# Altium schematic sheet fpga12-serdes-power.SchDoc
size Tabloid; SheetNumber: 47; SheetTotal: 71
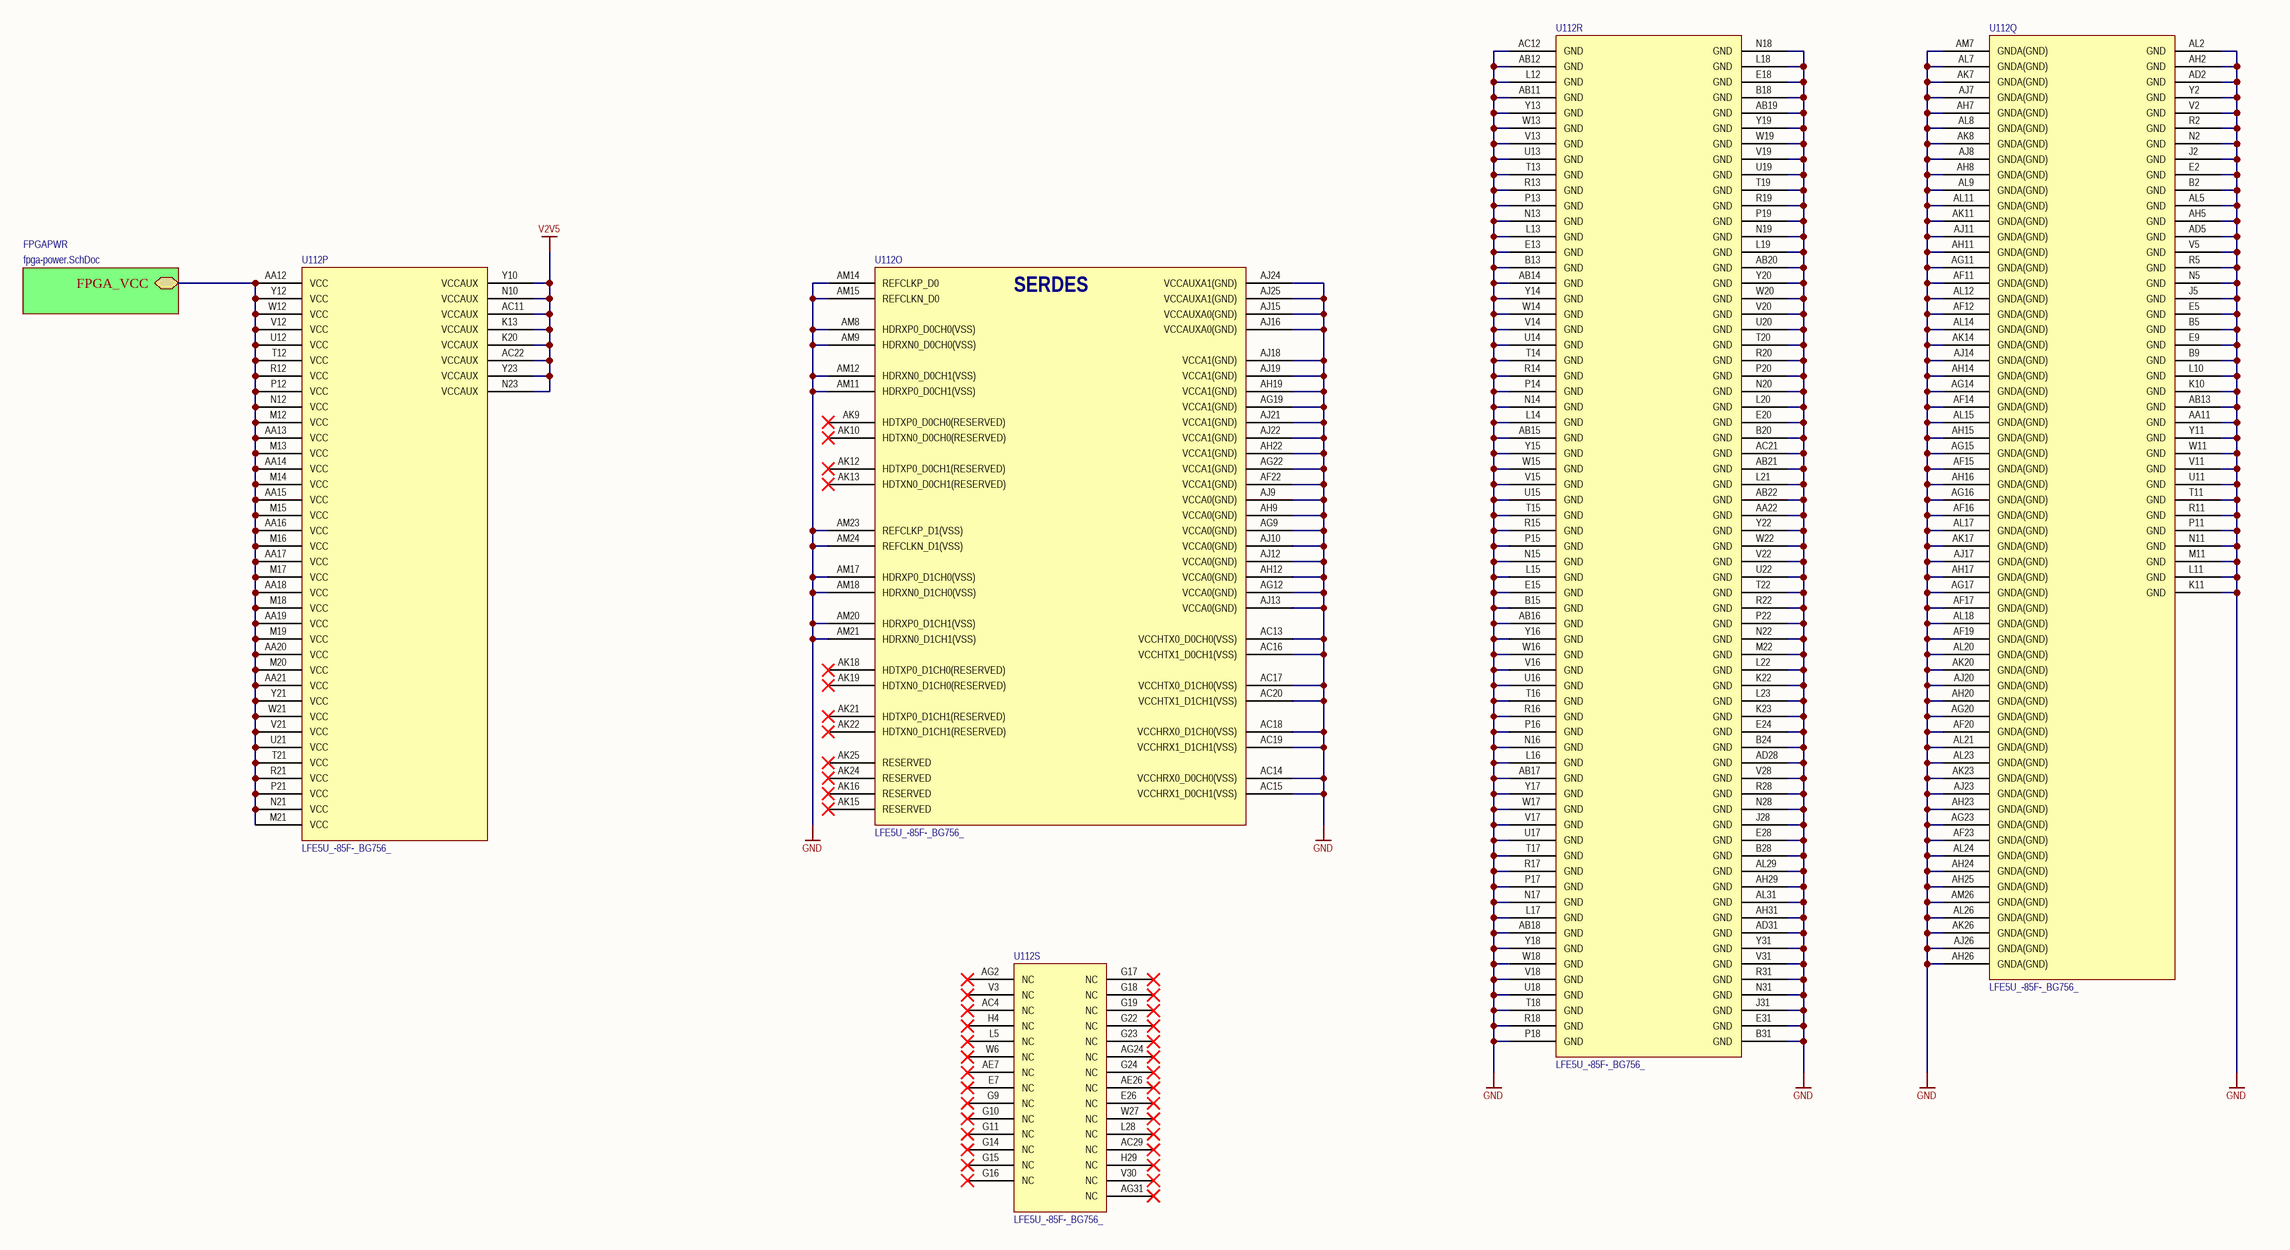
[diagram p0: fpga12-serdes-power.SchDoc]

## Parts
U112  LFE5U_-85F-_BG756_  [caBGA756]  (parts O,P,Q,R,S of 19)

## Sub-sheets
FPGAPWR = fpga-power.SchDoc: FPGA_VCC

## Nets
GND: U112.AA11(GND) U112.AA22(GND) U112.AB11(GND) U112.AB12(GND) U112.AB13(GND) U112.AB14(GND) U112.AB15(GND) U112.AB16(GND) U112.AB17(GND) U112.AB18(GND) U112.AB19(GND) U112.AB20(GND) U112.AB21(GND) U112.AB22(GND) U112.AC12(GND) U112.AC13(VCCHTX0_D0CH0(VSS)) U112.AC14(VCCHRX0_D0CH0(VSS)) U112.AC15(VCCHRX1_D0CH1(VSS)) U112.AC16(VCCHTX1_D0CH1(VSS)) U112.AC17(VCCHTX0_D1CH0(VSS)) U112.AC18(VCCHRX0_D1CH0(VSS)) U112.AC19(VCCHRX1_D1CH1(VSS)) U112.AC20(VCCHTX1_D1CH1(VSS)) U112.AC21(GND) U112.AD2(GND) U112.AD5(GND) U112.AD28(GND) U112.AD31(GND) U112.AF11(GNDA(GND)) U112.AF12(GNDA(GND)) U112.AF14(GNDA(GND)) U112.AF15(GNDA(GND)) U112.AF16(GNDA(GND)) U112.AF17(GNDA(GND)) U112.AF19(GNDA(GND)) U112.AF20(GNDA(GND)) U112.AF22(VCCA1(GND)) U112.AF23(GNDA(GND)) U112.AG9(VCCA0(GND)) U112.AG11(GNDA(GND)) U112.AG12(VCCA0(GND)) U112.AG14(GNDA(GND)) U112.AG15(GNDA(GND)) U112.AG16(GNDA(GND)) U112.AG17(GNDA(GND)) U112.AG19(VCCA1(GND)) U112.AG20(GNDA(GND)) U112.AG22(VCCA1(GND)) U112.AG23(GNDA(GND)) U112.AH2(GND) U112.AH5(GND) U112.AH7(GNDA(GND)) U112.AH8(GNDA(GND)) U112.AH9(VCCA0(GND)) U112.AH11(GNDA(GND)) U112.AH12(VCCA0(GND)) U112.AH14(GNDA(GND)) U112.AH15(GNDA(GND)) U112.AH16(GNDA(GND)) U112.AH17(GNDA(GND)) U112.AH19(VCCA1(GND)) U112.AH20(GNDA(GND)) U112.AH22(VCCA1(GND)) U112.AH23(GNDA(GND)) U112.AH24(GNDA(GND)) U112.AH25(GNDA(GND)) U112.AH26(GNDA(GND)) U112.AH29(GND) U112.AH31(GND) U112.AJ7(GNDA(GND)) U112.AJ8(GNDA(GND)) U112.AJ9(VCCA0(GND)) U112.AJ10(VCCA0(GND)) U112.AJ11(GNDA(GND)) U112.AJ12(VCCA0(GND)) U112.AJ13(VCCA0(GND)) U112.AJ14(GNDA(GND)) U112.AJ15(VCCAUXA0(GND)) U112.AJ16(VCCAUXA0(GND)) U112.AJ17(GNDA(GND)) U112.AJ18(VCCA1(GND)) U112.AJ19(VCCA1(GND)) U112.AJ20(GNDA(GND)) U112.AJ21(VCCA1(GND)) U112.AJ22(VCCA1(GND)) U112.AJ23(GNDA(GND)) U112.AJ24(VCCAUXA1(GND)) U112.AJ25(VCCAUXA1(GND)) U112.AJ26(GNDA(GND)) U112.AK7(GNDA(GND)) U112.AK8(GNDA(GND)) U112.AK11(GNDA(GND)) U112.AK14(GNDA(GND)) U112.AK17(GNDA(GND)) U112.AK20(GNDA(GND)) U112.AK23(GNDA(GND)) U112.AK26(GNDA(GND)) U112.AL2(GND) U112.AL5(GND) U112.AL7(GNDA(GND)) U112.AL8(GNDA(GND)) U112.AL9(GNDA(GND)) U112.AL11(GNDA(GND)) U112.AL12(GNDA(GND)) U112.AL14(GNDA(GND)) U112.AL15(GNDA(GND)) U112.AL17(GNDA(GND)) U112.AL18(GNDA(GND)) U112.AL20(GNDA(GND)) U112.AL21(GNDA(GND)) U112.AL23(GNDA(GND)) U112.AL24(GNDA(GND)) U112.AL26(GNDA(GND)) U112.AL29(GND) U112.AL31(GND) U112.AM7(GNDA(GND)) U112.AM8(HDRXP0_D0CH0(VSS)) U112.AM9(HDRXN0_D0CH0(VSS)) U112.AM11(HDRXP0_D0CH1(VSS)) U112.AM12(HDRXN0_D0CH1(VSS)) U112.AM14(REFCLKP_D0) U112.AM15(REFCLKN_D0) U112.AM17(HDRXP0_D1CH0(VSS)) U112.AM18(HDRXN0_D1CH0(VSS)) U112.AM20(HDRXP0_D1CH1(VSS)) U112.AM21(HDRXN0_D1CH1(VSS)) U112.AM23(REFCLKP_D1(VSS)) U112.AM24(REFCLKN_D1(VSS)) U112.AM26(GNDA(GND)) U112.B2(GND) U112.B5(GND) U112.B9(GND) U112.B13(GND) U112.B15(GND) U112.B18(GND) U112.B20(GND) U112.B24(GND) U112.B28(GND) U112.B31(GND) U112.E2(GND) U112.E5(GND) U112.E9(GND) U112.E13(GND) U112.E15(GND) U112.E18(GND) U112.E20(GND) U112.E24(GND) U112.E28(GND) U112.E31(GND) U112.J2(GND) U112.J5(GND) U112.J28(GND) U112.J31(GND) U112.K10(GND) U112.K11(GND) U112.K22(GND) U112.K23(GND) U112.L10(GND) U112.L11(GND) U112.L12(GND) U112.L13(GND) U112.L14(GND) U112.L15(GND) U112.L16(GND) U112.L17(GND) U112.L18(GND) U112.L19(GND) U112.L20(GND) U112.L21(GND) U112.L22(GND) U112.L23(GND) U112.M11(GND) U112.M22(GND) U112.N2(GND) U112.N5(GND) U112.N11(GND) U112.N13(GND) U112.N14(GND) U112.N15(GND) U112.N16(GND) U112.N17(GND) U112.N18(GND) U112.N19(GND) U112.N20(GND) U112.N22(GND) U112.N28(GND) U112.N31(GND) U112.P11(GND) U112.P13(GND) U112.P14(GND) U112.P15(GND) U112.P16(GND) U112.P17(GND) U112.P18(GND) U112.P19(GND) U112.P20(GND) U112.P22(GND) U112.R2(GND) U112.R5(GND) U112.R11(GND) U112.R13(GND) U112.R14(GND) U112.R15(GND) U112.R16(GND) U112.R17(GND) U112.R18(GND) U112.R19(GND) U112.R20(GND) U112.R22(GND) U112.R28(GND) U112.R31(GND) U112.T11(GND) U112.T13(GND) U112.T14(GND) U112.T15(GND) U112.T16(GND) U112.T17(GND) U112.T18(GND) U112.T19(GND) U112.T20(GND) U112.T22(GND) U112.U11(GND) U112.U13(GND) U112.U14(GND) U112.U15(GND) U112.U16(GND) U112.U17(GND) U112.U18(GND) U112.U19(GND) U112.U20(GND) U112.U22(GND) U112.V2(GND) U112.V5(GND) U112.V11(GND) U112.V13(GND) U112.V14(GND) U112.V15(GND) U112.V16(GND) U112.V17(GND) U112.V18(GND) U112.V19(GND) U112.V20(GND) U112.V22(GND) U112.V28(GND) U112.V31(GND) U112.W11(GND) U112.W13(GND) U112.W14(GND) U112.W15(GND) U112.W16(GND) U112.W17(GND) U112.W18(GND) U112.W19(GND) U112.W20(GND) U112.W22(GND) U112.Y2(GND) U112.Y11(GND) U112.Y13(GND) U112.Y14(GND) U112.Y15(GND) U112.Y16(GND) U112.Y17(GND) U112.Y18(GND) U112.Y19(GND) U112.Y20(GND) U112.Y22(GND) U112.Y31(GND)
V2V5: U112.AC11(VCCAUX) U112.AC22(VCCAUX) U112.K13(VCCAUX) U112.K20(VCCAUX) U112.N10(VCCAUX) U112.N23(VCCAUX) U112.Y10(VCCAUX) U112.Y23(VCCAUX)
NetU112_AA12: U112.AA12(VCC) U112.AA13(VCC) U112.AA14(VCC) U112.AA15(VCC) U112.AA16(VCC) U112.AA17(VCC) U112.AA18(VCC) U112.AA19(VCC) U112.AA20(VCC) U112.AA21(VCC) U112.M12(VCC) U112.M13(VCC) U112.M14(VCC) U112.M15(VCC) U112.M16(VCC) U112.M17(VCC) U112.M18(VCC) U112.M19(VCC) U112.M20(VCC) U112.M21(VCC) U112.N12(VCC) U112.N21(VCC) U112.P12(VCC) U112.P21(VCC) U112.R12(VCC) U112.R21(VCC) U112.T12(VCC) U112.T21(VCC) U112.U12(VCC) U112.U21(VCC) U112.V12(VCC) U112.V21(VCC) U112.W12(VCC) U112.W21(VCC) U112.Y12(VCC) U112.Y21(VCC) ; sheet FPGAPWR/FPGA_VCC

Not connected (* = marked no-connect by the designer): U112 AC4(NC)* AC29(NC)* AE7(NC)* AE26(NC)* AG2(NC)* AG24(NC)* AG31(NC)* AK9(HDTXP0_D0CH0(RESERVED))* AK10(HDTXN0_D0CH0(RESERVED))* AK12(HDTXP0_D0CH1(RESERVED))* AK13(HDTXN0_D0CH1(RESERVED))* AK15(RESERVED)* AK16(RESERVED)* AK18(HDTXP0_D1CH0(RESERVED))* AK19(HDTXN0_D1CH0(RESERVED))* AK21(HDTXP0_D1CH1(RESERVED))* AK22(HDTXN0_D1CH1(RESERVED))* AK24(RESERVED)* AK25(RESERVED)* E7(NC)* E26(NC)* G9(NC)* G10(NC)* G11(NC)* G14(NC)* G15(NC)* G16(NC)* G17(NC)* G18(NC)* G19(NC)* G22(NC)* G23(NC)* G24(NC)* H4(NC)* H29(NC)* L5(NC)* L28(NC)* V3(NC)* V30(NC)* W6(NC)* W27(NC)*

## Notes on the sheet
- (in symbol LFE5U_-85F-_BG756_, part O) SERDES

## Library data of the parts
U112 = LFE5U_-85F-_BG756_: ECP5 FPGA, 85k LUT, 756-caBGA; Manufacturer: Lattice Semiconductor; Manufacturer P/N: LFE5U_-85F-_BG756_